# Altium schematic sheet electromechanical-switching-hw.SchDoc
size A3; SheetNumber: 3; SheetTotal: 3
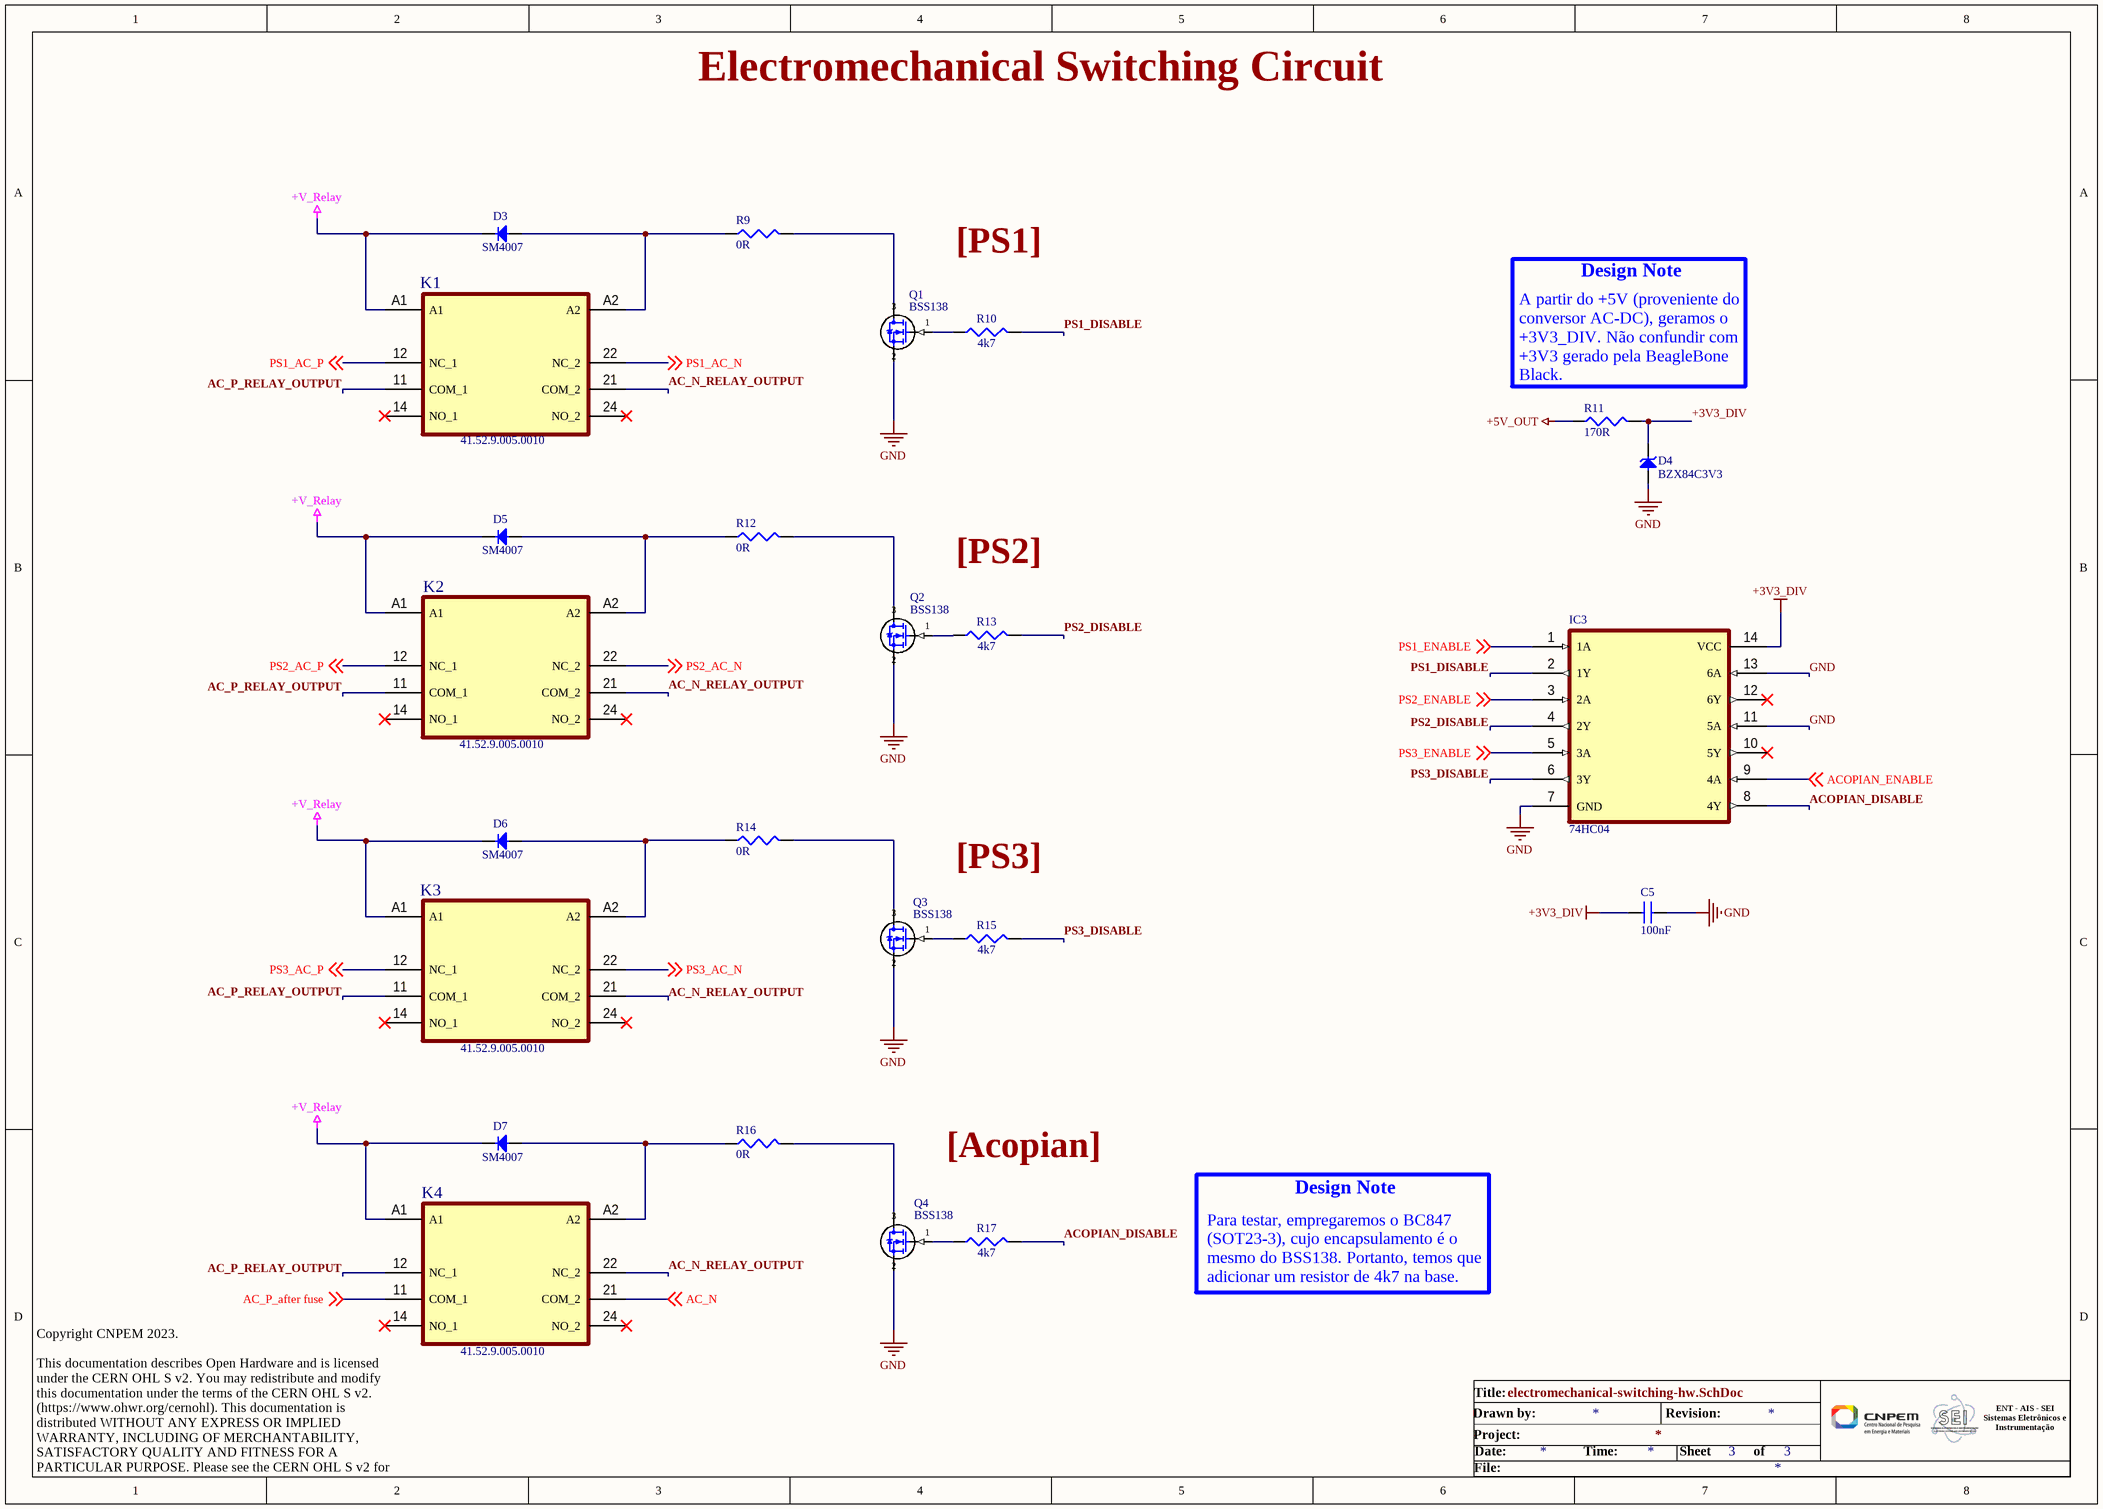
[diagram p0: electromechanical-switching-hw.SchDoc]

## Parts
C5  100nF  [C0805]
D3  SM4007  [SM4007]
D4  BZX84C3V3  [SOT_23_3]
D5  SM4007  [SM4007]
D6  SM4007  [SM4007]
D7  SM4007  [SM4007]
IC3  74HC04  [SOIC-14]
K1  41.52.9.005.0010  [41.52.9.005.0010]
K2  41.52.9.005.0010  [41.52.9.005.0010]
K3  41.52.9.005.0010  [41.52.9.005.0010]
K4  41.52.9.005.0010  [41.52.9.005.0010]
Q1  BSS138  [SOT_23_3]
Q2  BSS138  [SOT_23_3]
Q3  BSS138  [SOT_23_3]
Q4  BSS138  [SOT_23_3]
R9  0R  [R1210]
R10  4k7  [Resistor 0805]
R11  170R  [R1210]
R12  0R  [R1210]
R13  4k7  [Resistor 0805]
R14  0R  [R1210]
R15  4k7  [Resistor 0805]
R16  0R  [R1210]
R17  4k7  [Resistor 0805]

## Nets
+3V3_DIV: C5.2 D4.3 IC3.14(VCC) R11.2
+5V_OUT: R11.1
+V_Relay: D3.1 D5.1 D6.1 D7.1 K1.A1 K2.A1 K3.A1 K4.A1
GND: C5.1 D4.1 IC3.7(GND) IC3.11(5A) IC3.13(6A) Q1.2(S) Q2.2(S) Q3.2(S) Q4.2(S)
AC_N: K4.21(COM_2) ; off-sheet AC_N
AC_N_RELAY_OUTPUT: K1.21(COM_2) K2.21(COM_2) K3.21(COM_2) K4.22(NC_2)
AC_P_after fuse: K4.11(COM_1) ; off-sheet AC_P_after fuse
AC_P_RELAY_OUTPUT: K1.11(COM_1) K2.11(COM_1) K3.11(COM_1) K4.12(NC_1)
ACOPIAN_DISABLE: IC3.8(4Y) R17.2
ACOPIAN_ENABLE: IC3.9(4A) ; off-sheet ACOPIAN_ENABLE
PS1_AC_N: K1.22(NC_2) ; off-sheet PS1_AC_N
PS1_AC_P: K1.12(NC_1) ; off-sheet PS1_AC_P
PS1_DISABLE: IC3.2(1Y) R10.2
PS1_ENABLE: IC3.1(1A) ; off-sheet PS1_ENABLE
PS2_AC_N: K2.22(NC_2) ; off-sheet PS2_AC_N
PS2_AC_P: K2.12(NC_1) ; off-sheet PS2_AC_P
PS2_DISABLE: IC3.4(2Y) R13.2
PS2_ENABLE: IC3.3(2A) ; off-sheet PS2_ENABLE
PS3_AC_N: K3.22(NC_2) ; off-sheet PS3_AC_N
PS3_AC_P: K3.12(NC_1) ; off-sheet PS3_AC_P
PS3_DISABLE: IC3.6(3Y) R15.2
PS3_ENABLE: IC3.5(3A) ; off-sheet PS3_ENABLE
NetD3_2: D3.2 K1.A2 R9.1
NetD5_2: D5.2 K2.A2 R12.1
NetD6_2: D6.2 K3.A2 R14.1
NetD7_2: D7.2 K4.A2 R16.1
NetQ1_1: Q1.1(G) R10.1
NetQ1_3: Q1.3(D) R9.2
NetQ2_1: Q2.1(G) R13.1
NetQ2_3: Q2.3(D) R12.2
NetQ3_1: Q3.1(G) R15.1
NetQ3_3: Q3.3(D) R14.2
NetQ4_1: Q4.1(G) R17.1
NetQ4_3: Q4.3(D) R16.2

Not connected (* = marked no-connect by the designer): IC3 10(5Y)* 12(6Y)*; K1 14(NO_1)* 24(NO_2)*; K2 14(NO_1)* 24(NO_2)*; K3 14(NO_1)* 24(NO_2)*; K4 14(NO_1)* 24(NO_2)*

## Notes on the sheet
- Electromechanical Switching Circuit
- [PS1]
- Design Note
- (near R11) A partir do +5V (proveniente do conversor AC-DC), geramos o +3V3_DIV. Não confundir com +3V3 gerado pela BeagleBone Black.
- [PS2]
- [PS3]
- [Acopian]
- Para testar, empregaremos o BC847 (SOT23-3), cujo encapsulamento é o mesmo do BSS138. Portanto, temos que adicionar um resistor de 4k7 na base.
- Title:
- Date:
- Project:
- Drawn by:
- Time:
- Revision:
- Sheet
- of
- ENT - AIS - SEI
  Sistemas Eletrônicos e
  Instrumentação
- Copyright CNPEM 2023.
  This documentation describes Open Hardware and is licensed under the CERN OHL S v2. You may redistribute and modify this documentation under the terms of the CERN OHL S v2. (https://www.ohwr.org/cernohl). This documentation is distributed WITHOUT ANY EXPRESS OR IMPLIED WARRANTY, INCLUDING OF MERCHANTABILITY, SATISFACTORY QUALITY AND FITNESS FOR A PARTICULAR PURPOSE. Please see the CERN OHL S v2 for applicable conditions.
- File:

## Library data of the parts
C5 = Capacitor 100nF
D4 = Zener BZX84C3V3: Zener Diode 3V3
IC3 = 74HC04 - SOIC14: SOIC14
K1-K4 = 41.52.9.005.0010: Low Profile PCB Relay, 2 CO DPDT, 8A, Coil: 5VDC
Q1-Q4 = BSS138: MOSFET N-Channel; Supplier 1: Digi-Key; Supplier Part Number 1: BSS138DKR-ND
R9 R12 R14 R16 = Resistor 0R: Size 1210
R10 R13 R15 R17 = Resistor 4k7: Size 0805
R11 = Resistor 170R: Size 1210